# Altium schematic sheet MotorConnector.SchDoc
size A; SheetNumber: 10; SheetTotal: 15
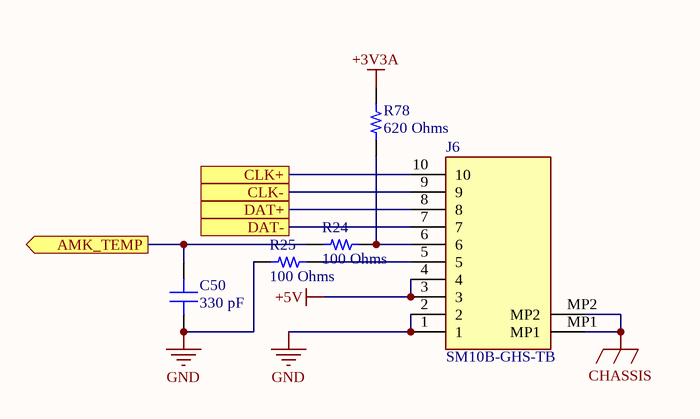
[diagram p0: MotorConnector.SchDoc]

## Parts
C50  330 pF  [CAP 0402_1005]
J6  SM10B-GHS-TB  [SM10BGHSTB]
R24  100 Ohms  [RES 0402_1005]
R25  100 Ohms  [RES 0402_1005]
R78  620 Ohms  [YAGEO RES 0402_1005]

## Ports
AMK_TEMP (out), CLK+, CLK-, DAT+, DAT-

## Nets
+3V3A: R78.2
+5V: J6.3 J6.4
CHASSIS: J6.MP1 J6.MP2
GND: C50.1 J6.1 J6.2 R25.1
AMK_TEMP: C50.2 R24.1 ; port AMK_TEMP
CLK+: J6.10 ; port CLK+
CLK-: J6.9 ; port CLK-
DAT+: J6.8 ; port DAT+
DAT-: J6.7 ; port DAT-
NetJ6_5: J6.5 R25.2
NetJ6_6: J6.6 R24.2 R78.1

## Library data of the parts
C50 = HMK105B7331MV-F: CAP CER 330PF 100V X7R 0402; manufacturer: Taiyo Yuden; Tolerance: ±20%; Part Number: HMK105B7331MV-F; Capacitance: 330 pF; Applications: SMPS Filtering; componentlink1description: Datasheet; componentlink1url: http://www.yuden.co.jp/productdata/catalog/mlcc06_e.pdf; componentlink2description: DigiKey Link; componentlink2url: https://www.digikey.com/en/products/detail/taiyo-yuden/HMK105B7331MV-F/6563581; Device Package: 0402 (1005 Metric); lastupdated: 2/9/2024 8:04:38 PM; Lifecycle Status: Active; Minimum Order: 1; Mounting Type: Surface Mount, MLCC; Operating Temperature: -55°C ~ 125°C; Package / Case: 0402 (1005 Metric); packaging: TapeAndReel; partid: 1855; Part Status: Active; price: 0.03; series: M; Size / Dimension: 0.039" L x 0.020" W (1.00mm x 0.50mm); Supplier 1: DigiKey; Supplier Part Number 1: 587-4988-1-ND; Temperature Coefficient: X7R; Thickness (Max): 0.022" (0.55mm); value: 330 pF; Voltage - Rated: 100V
J6 = SM10B-GHS-TB: Connector; Manufacturer_Name: 3D SYSTEMS; Datasheet Link: https://4donline.ihs.com/images/VipMasterIC/IC/JSTM/JSTMS02184/JSTMS02184-1.pdf?hkey=EF798316E3902B6ED9A73243A3159BB0; Height: 4.25mm; Manufacturer_Part_Number: SM10B-GHS-TB
R24 R25 = WR04X1000FTL: RES 100 OHM 1% 1/16W 0402; Manufacturer: Walsin Technology Corporation; Power (Watts): 0.063W, 1/16W; Temperature Coefficient: ±100ppm/°C; Part Number: WR04X1000FTL; Value: 100 Ohms; ComponentLink1Description: Datasheet; ComponentLink1URL: https://www.passivecomponent.com/wp-content/uploads/chipR/ASC_WR.pdf; ComponentLink2Description: DigiKey Link; ComponentLink2URL: https://www.digikey.com/en/products/detail/walsin-technology-corporation/WR04X1000FTL/13241075; Composition: Thick Film; Device Package: 0402 (1005 Metric); Height - Seated (Max): 0.016" (0.40mm); LastUpdated: 2/9/2024 8:28:55 PM; Lifecycle Status: Active; Minimum Order: 1; Number of Terminations: 2; Operating Temperature: -55°C ~ 155°C; Package / Case: 0402 (1005 Metric); Packaging: CutTape; PartId: 64787; Part Status: Active; Price: 0.01; Resistance: 100 Ohms; Series: WR; Size / Dimension: 0.039" L x 0.020" W (1.00mm x 0.50mm); Supplier 1: DigiKey; Supplier Part Number 1: 1292-WR04X1000FTLCT-ND; Supplier Device Package: 0402; Tolerance: ±1%
R78 = RC0402JR-07620RL: RES 620 OHM 5% 1/16W 0402; Manufacturer: Yageo; Power (Watts): 0.063W, 1/16W; Temperature Coefficient: ±100ppm/°C; Part Number: RC0402JR-07620RL; Value: 620 Ohms; ComponentLink1Description: Datasheet; ComponentLink1URL: https://www.yageo.com/upload/media/product/productsearch/datasheet/rchip/PYu-RC_Group_51_RoHS_L_10.pdf; ComponentLink2Description: DigiKey Link; ComponentLink2URL: https://www.digikey.com/en/products/detail/yageo/RC0402JR-07620RL/726498; Composition: Thick Film; Device Package: 0402 (1005 Metric); Features: Moisture Resistant; Height - Seated (Max): 0.016" (0.40mm); LastUpdated: 8/31/2025 3:04:15 PM; Lifecycle Status: Active; Minimum Order: 1; Number of Terminations: 2; Operating Temperature: -55°C ~ 155°C; Package / Case: 0402 (1005 Metric); Packaging: CutTape; PartId: 4894; Part Status: Active; Price: 0.01; Resistance: 620 Ohms; Series: RC_L; Size / Dimension: 0.039" L x 0.020" W (1.00mm x 0.50mm); Supplier 1: DigiKey; Supplier Part Number 1: 311-620JRCT-ND; Supplier Device Package: 0402; Tolerance: ±5%